# EAGLE design ledDriver (EAGLE 8.6.3)
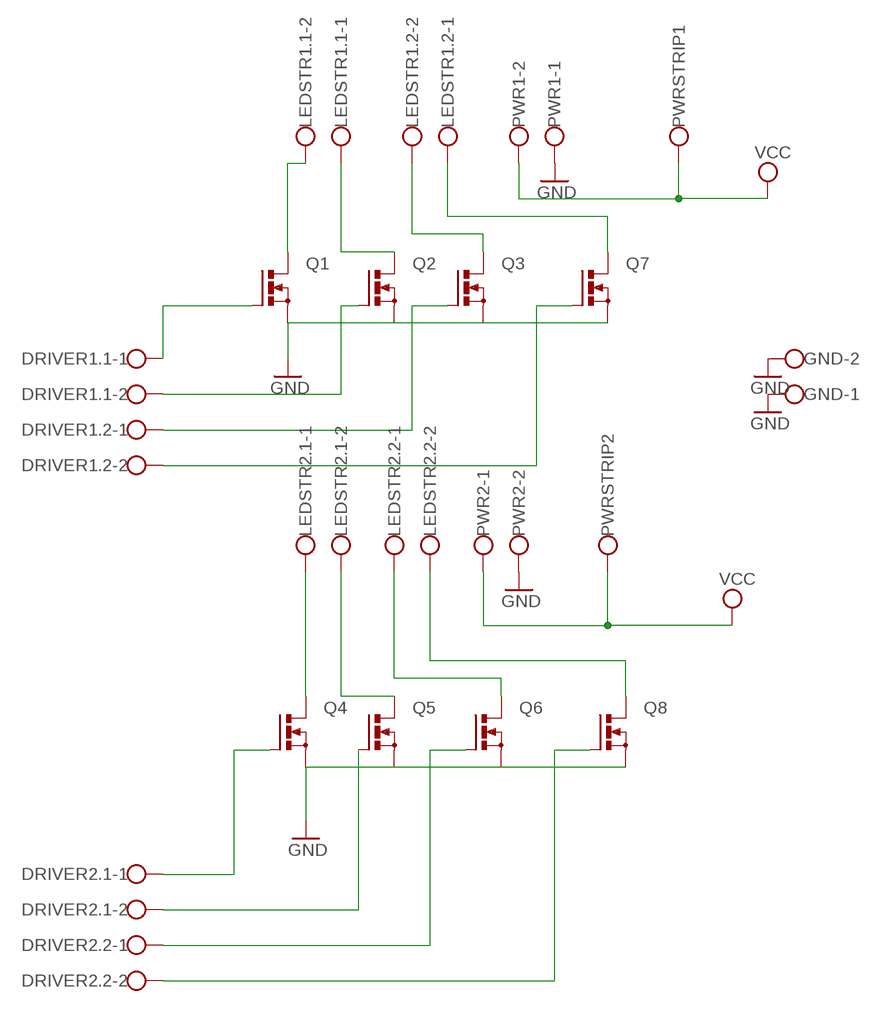
[diagram p0: schematic, sheet 1]

## Parts
DRIVER1.1  W237-102  [W237-102]
DRIVER1.2  W237-102  [W237-102]
DRIVER2.1  W237-102  [W237-102]
DRIVER2.2  W237-102  [W237-102]
GND  W237-102  [W237-102]
LEDSTR1.1  W237-102  [W237-102]
LEDSTR1.2  W237-102  [W237-102]
LEDSTR2.1  W237-102  [W237-102]
LEDSTR2.2  W237-102  [W237-102]
PWR1  W237-102  [W237-102]
PWR2  W237-102  [W237-102]
PWRSTRIP1  W237-112  [W237-112]
PWRSTRIP2  W237-112  [W237-112]
Q1  PMOSFET_NTO220BV  [TO220BV]
Q2  PMOSFET_NTO220BV  [TO220BV]
Q3  PMOSFET_NTO220BV  [TO220BV]
Q4  PMOSFET_NTO220BV  [TO220BV]
Q5  PMOSFET_NTO220BV  [TO220BV]
Q6  PMOSFET_NTO220BV  [TO220BV]
Q7  PMOSFET_NTO220BV  [TO220BV]
Q8  PMOSFET_NTO220BV  [TO220BV]

## Nets
GND: GND.1 GND.2 PWR1.1 PWR2.2 Q1.S Q2.S Q3.S Q4.S Q5.S Q6.S Q7.S Q8.S
N$1: LEDSTR2.1.1 Q4.D
N$2: LEDSTR2.1.2 Q5.D
N$3: LEDSTR1.1.2 Q1.D
N$4: LEDSTR1.1.1 Q2.D
N$5: LEDSTR1.2.2 Q3.D
N$6: LEDSTR1.2.1 Q7.D
N$7: LEDSTR2.2.1 Q6.D
N$8: LEDSTR2.2.2 Q8.D
N$9: DRIVER2.2.1 Q6.G
N$10: DRIVER2.2.2 Q8.G
N$11: DRIVER1.1.1 Q1.G
N$12: DRIVER1.1.2 Q2.G
N$13: DRIVER1.2.1 Q3.G
N$14: DRIVER1.2.2 Q7.G
N$15: DRIVER2.1.1 Q4.G
N$16: DRIVER2.1.2 Q5.G
VCC1: PWR1.2 PWRSTRIP1.1(KL) ; supply symbol labelled VCC
VCC2: PWR2.1 PWRSTRIP2.1(KL) ; supply symbol labelled VCC

## Library data of the parts
DRIVER1.1 DRIVER1.2 DRIVER2.1 DRIVER2.2 GND LEDSTR1.1 LEDSTR1.2 LEDSTR2.1 LEDSTR2.2 PWR1 PWR2 = con-wago-500:W237-102: WAGO SCREW CLAMP; MPN: 237-102; OC_FARNELL: unknown; OC_NEWARK: 70K9898
PWRSTRIP1 PWRSTRIP2 = con-wago-500:W237-112: WAGO SCREW CLAMP; MPN: 237-112; OC_FARNELL: unknown; OC_NEWARK: 76R2974
Q1-Q8 = transistor-power:PMOSFET_N: Power MOSFET N-Channel

## Board
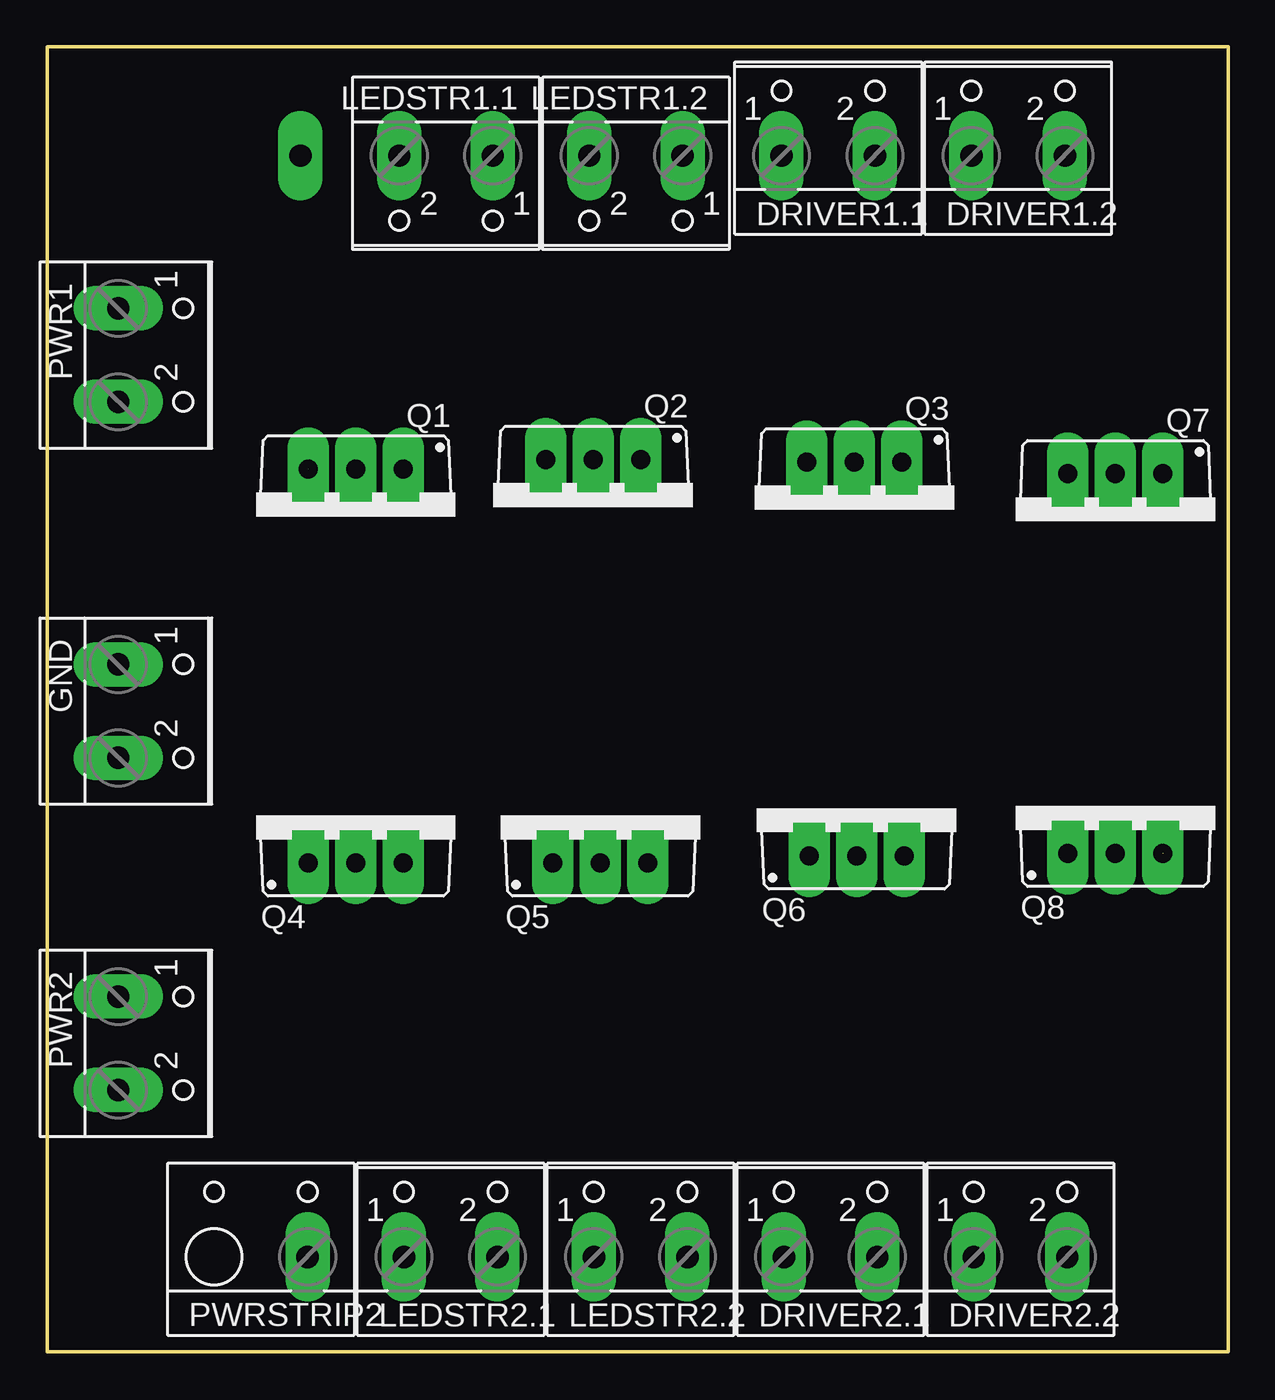
[diagram p1: board, top side]
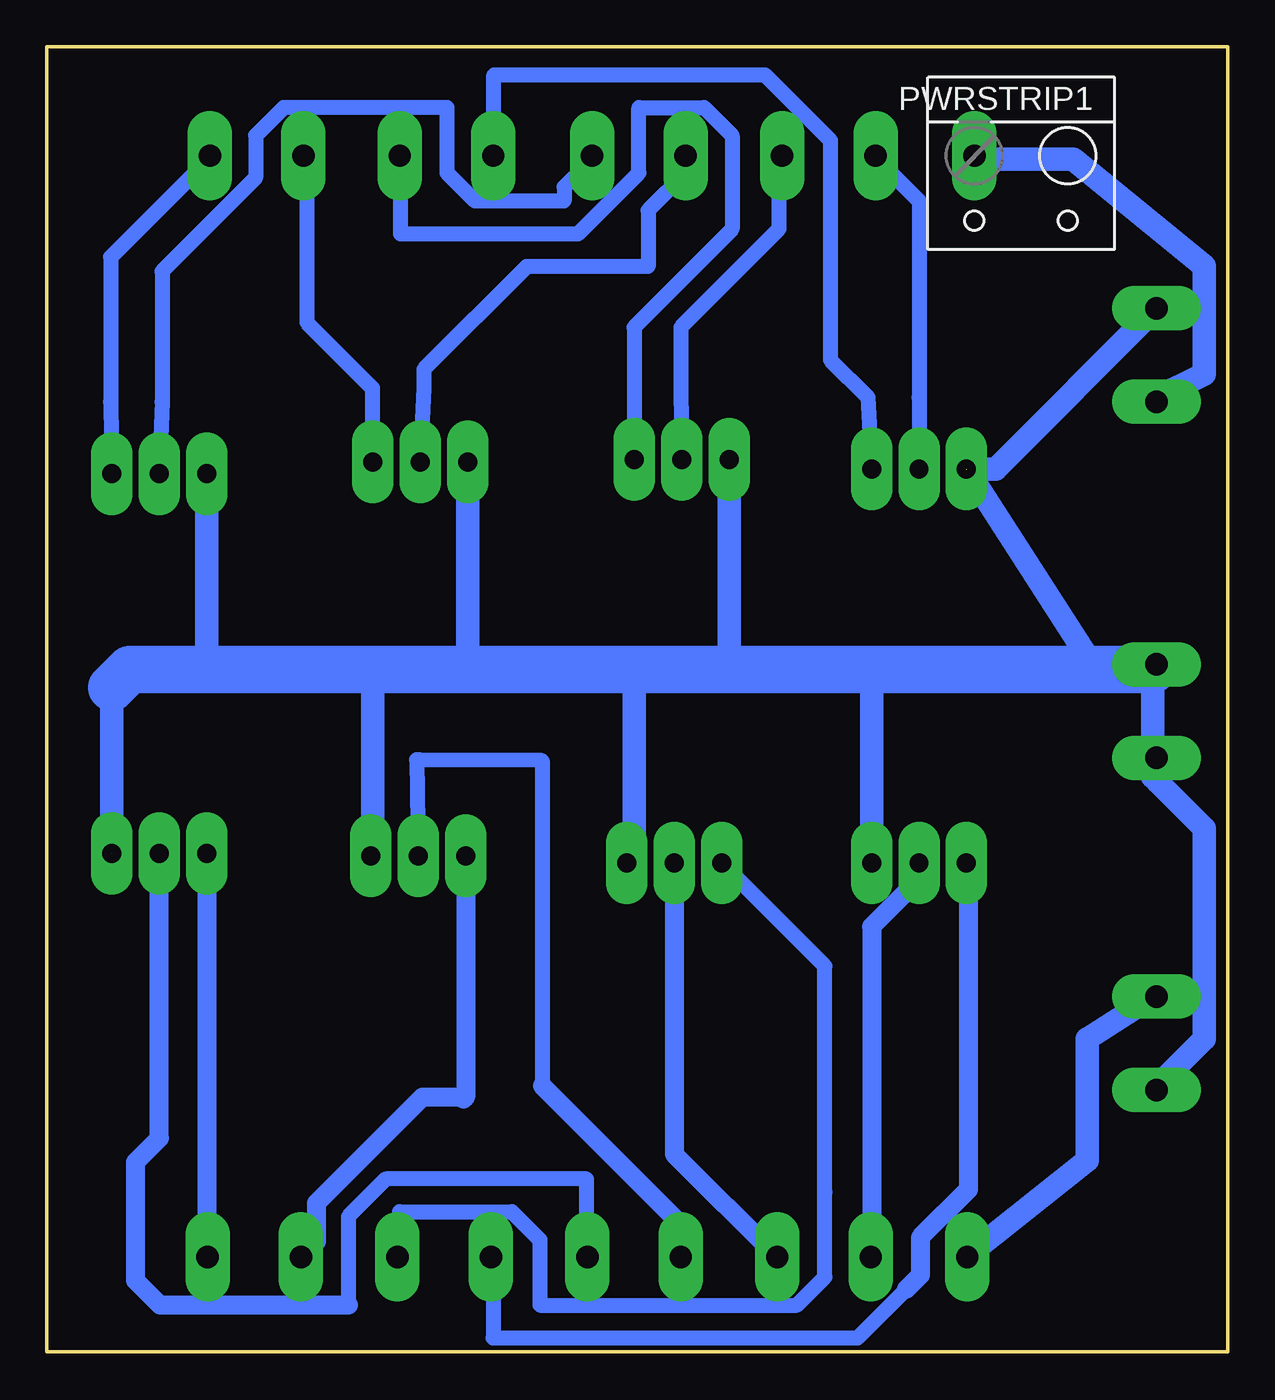
[diagram p2: board, bottom side, seen from below]

Size 63.17 x 69.84 mm. Coordinates in mm from the lower left corner, seen from the top.
Outline: 0,0 63.17,0 63.17,69.84 0,69.84 0,0
Copper layers (1*16): Top 0.035mm / dielectric 1.5mm / Bottom 0.035mm
Design rules "hobby": minimum track width 0.8mm, minimum drill 0.8mm, track to track 0.8mm, track to pad 0.8mm, pad to pad 0.45mm, via to via 0.8mm, smd to smd 8mil, copper to edge 10mil, drill to drill 8mil, minimum pad ring 0.6mm, minimum via ring 0.6mm, stop-mask expansion 0mil, vias tented up to drill 0mil, thermal gap 10mil

### Footprints (pad centres in the part's own frame; a part is rotated, then mirrored left to right if it is on the bottom)
W237-102 = drill 1.194 long: 1 -2.5,-1.27; 2 2.5,-1.27
W237-112 = drill 1.194 long: 1 2.5,-1.27
TO220BV = drill 1.016 long: D 0,-2.54; G -2.54,-2.54; S 2.54,-2.54

### Placement (x,y rotation side)
DRIVER1.1  41.78,65.28 0 top
DRIVER1.2  51.94,65.28 0 top
DRIVER2.1  41.91,6.35 0 top
DRIVER2.2  52.07,6.35 0 top
GND  5.08,34.29 270 top
LEDSTR1.1  21.34,62.74 180 top
LEDSTR1.2  31.5,62.74 180 top
LEDSTR2.1  21.59,6.35 0 top
LEDSTR2.2  31.75,6.35 0 top
PWR1  5.08,53.34 270 top
PWR2  5.08,16.51 270 top
PWRSTRIP1  11.05,62.74 180 bottom
PWRSTRIP2  11.43,6.35 0 top
Q1  16.51,44.7 180 top
Q2  29.21,45.21 180 top
Q3  43.18,45.09 180 top
Q4  16.51,28.7 0 top
Q5  29.59,28.7 0 top
Q6  43.31,29.08 0 top
Q7  57.15,44.45 180 top
Q8  57.15,29.21 0 top

### Tracks (layer width: path | path; a pad name or v marks a point on that pad's centre or on a via)
GND  (2 unrouted)
  Bottom 0.8: 3.75,30.5 GND.2
  Bottom 1.27: 3.75,30.5 1.25,28 1.25,16.75 3.75,14.25 PWR2.2 | GND.2 4,30.75 4,36.52 GND.1 | PWR1.1 12.41,47.24 Q1.S 7.05,36.52 | 59.69,35.56 Q8.S | Q7.S 54.61,36.52 | Q3.S 40.64,36.52 | Q6.S 45.72,26.67 45.72,36.52 | Q5.S 31.75,26.54 31.75,36.52 | Q2.S 26.67,36.52 | Q4.S 19.05,36.52
  Bottom 2.54: 4,36.52 7.05,36.52 19.05,36.52 26.67,36.52 31.75,36.52 40.64,36.52 45.72,36.52 54.61,36.52 58.73,36.52 59.69,35.56
N$1
  Bottom 0.8: 19.04,5.25 LEDSTR2.1.1
  Bottom 1.016: Q4.D 16.63,26.04 16.63,25.16 19.04,22.75 19.04,5.25
N$2
  Bottom 1.016: Q5.D 29.59,10.58 LEDSTR2.1.2
N$3
  Bottom 0.8: Q1.D 16.5,51.08 16.5,61.58 18.75,63.83 LEDSTR1.1.2
N$4
  Bottom 0.8: Q2.D 29.25,51.58 29.25,54.83 24,60.08 24,63.83 LEDSTR1.1.1
N$5
  Bottom 0.8: Q3.D 43,51.58 43,52.58 37.5,58.08 31,58.08 31,61.08 29,63.08 29,63.83 LEDSTR1.2.2
N$6
  Bottom 0.8: Q7.D 57,50.83 57,57.83 52,62.83 52,65.08 50.5,66.58 41.75,66.58 41.75,63.08 40.25,61.58 35.5,61.58 35.5,62.33 34,63.83 LEDSTR1.2.1
N$7
  Bottom 0.8: 36.66,14.24 36.67,31.64 43.13,31.66 43.38,31.68 Q6.D
  Bottom 1.016: 36.66,14.24 29.25,6.83 LEDSTR2.2.1
N$8
  Bottom 0.8: 47.04,2.5 47.04,7.25 45.04,9.25 34.29,9.25 34.29,5.25 LEDSTR2.2.2
  Bottom 1.016: 47.04,2.5 57.11,2.5 58.42,3.81 58.42,10.16 57.15,11.43 Q8.D
N$9
  Bottom 1.016: Q6.G 40.77,13.63 | 40.77,13.63 40.88,13.52 | DRIVER2.2.1 48.75,5.9 48.75,7.96 43.08,13.63 40.77,13.63
N$10
  Bottom 0.8: 54.79,5.25 DRIVER2.2.2
  Bottom 1.016: Q8.G 54.61,5.43 54.79,5.25
N$11
  Bottom 0.8: Q1.G 19.25,51.08 21.25,53.08 21.25,64.83 24.75,68.33 39.25,68.33 39.25,64.08 DRIVER1.1.1
N$12
  Bottom 0.8: Q2.G 31.75,54.83 26.5,60.08 26.5,65.08 28,66.58 31.5,66.58 31.5,63.08 34.75,59.83 44.25,59.83 44.25,63.83 DRIVER1.1.2
N$13
  Bottom 0.8: Q3.G 45.75,51.58 49.25,55.08 49.25,63.83 DRIVER1.2.1
N$14
  Bottom 0.8: Q7.G 59.75,50.83 59.75,58.58 54.5,63.83 DRIVER1.2.2
N$15
  Bottom 0.8: 13.87,12.38 13.98,11.71 | 17.18,3.37 19.79,0.75 39.29,0.75 39.29,5 DRIVER2.1.1
  Bottom 1.016: Q4.G 13.87,26.07 13.87,12.38 13.87,8.68 16.43,6.12 16.43,4.11 17.18,3.37
N$16
  Bottom 0.8: 21.54,8.56 21.54,4 23.04,2.5 36.79,2.5 36.79,6 38.29,7.5 44.29,7.5 44.29,5.25 DRIVER2.1.2
  Bottom 0.813: 21.54,8.56 21.54,20.65 Q5.G
VCC1
  Bottom 0.8: 3.75,51.08 PWR1.2 | 13.5,63.83 PWRSTRIP1.1
  Bottom 1.27: 3.75,51.08 1.25,52.31 1.25,58.1 8.25,63.83 13.5,63.83
VCC2
  Bottom 1.27: PWRSTRIP2.1 13.79,5.25 7.52,10.25 7.52,16.75 4,19 PWR2.1